# Altium schematic sheet Sheet1.SchDoc
size A4
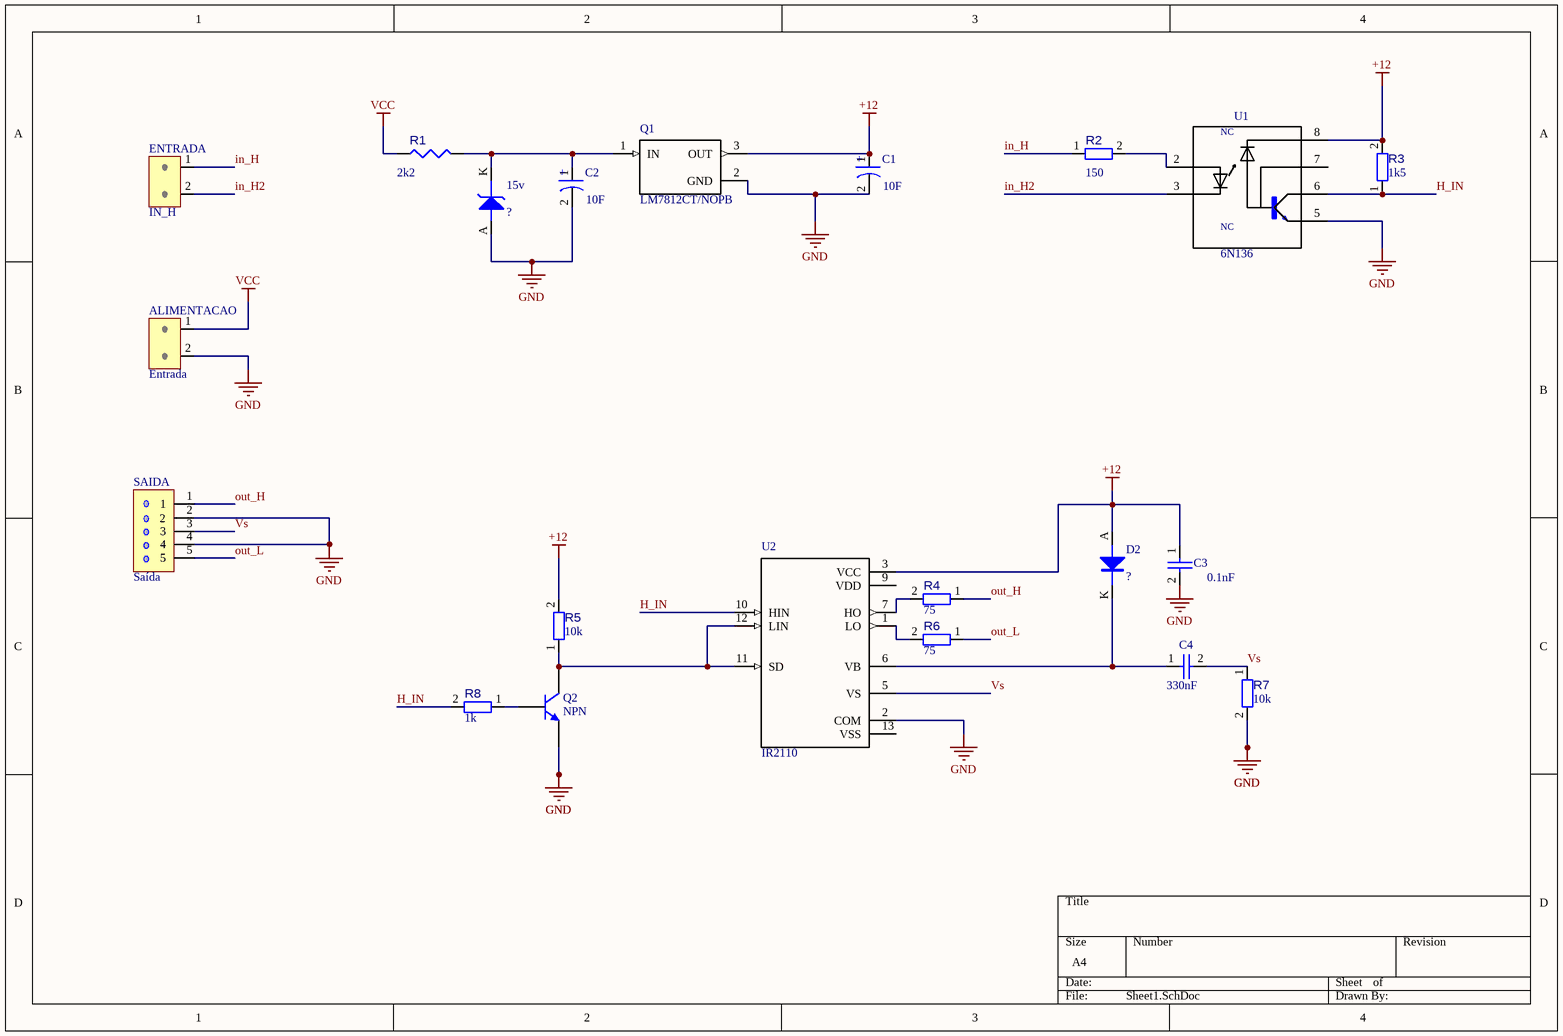
[diagram p0: Sheet1.SchDoc]

## Parts
15v  DIO_ZENER_DO35  [DIO_PTH_DO35]  (value not drawn)
ALIMENTACAO  Entrada  [HEADER_1X2]
C1  value 10F  [CAP_ALU_RADIAL_5MM]  (hidden comment: Electrolytic Capacitor)
C2  value 10F  [CAP_ALU_RADIAL_5MM]  (hidden comment: Electrolytic Capacitor)
C3  value 0.1nF  [Cap_POL_RADIAL_10mm]  (hidden comment: CAP_POL_RADIAL_16MM)
C4  value 330nF  [CAP_POL_RADIAL_16MM]  (hidden comment: CAP_POL_RADIAL_25.5MM)
D2  DIO_PTH_1N4007  [DIO_PTH_DO41]  (value not drawn)
ENTRADA  IN_H  [HEADER_1X2]
Q1  LM7812CT/NOPB  [*TO254P1054X470X2600-3]
Q2  NPN  [369-03]
R1  2k2  [RES_PTH_7.62MM]
R2  150  [RES_PTH_7.62MM]
R3  1k5  [RES_PTH_7.62MM]
R4  75  [RES_PTH_7.62MM]
R5  10k  [RES_PTH_7.62MM]
R6  75  [RES_PTH_7.62MM]
R7  10k  [RES_PTH_7.62MM]
R8  1k  [RES_PTH_7.62MM]
SAIDA  Saída  [CN_KK_5_5045-5]
U1  6N136  [*DIP762W50P254L977H451Q8]
U2  IR2110  [*DIP762W45P254L2019H533Q14]

## Nets
+12: C1.1 C3.1 D2.A Q1.3(OUT) R3.2 R5.2 U1.8(C/VCC) U2.3(VCC)
GND: 15v.A ALIMENTACAO.2 C1.2 C2.2 C3.2 Q1.2(GND) Q2.3(E) R7.2 SAIDA.2 SAIDA.4 U1.5(E/GND) U2.2(COM)
VCC: ALIMENTACAO.1 R1.1
H_IN: R3.1 R8.2 U1.6(C/VO) U2.10(HIN)
in_H: ENTRADA.1 R2.1
in_H2: ENTRADA.2 U1.3(C)
out_H: R4.1 SAIDA.1
out_L: R6.1 SAIDA.5
Vs: C4.2 R7.1 SAIDA.3 U2.5(VS)
Net15v_K: 15v.K C2.1 Q1.1(IN) R1.2
NetC4_1: C4.1 D2.K U2.6(VB)
NetQ2_1: Q2.1(C) R5.1 U2.11(SD) U2.12(LIN)
NetQ2_2: Q2.2(B) R8.1
NetR2_2: R2.2 U1.2(A)
NetR4_2: R4.2 U2.7(HO)
NetR6_2: R6.2 U2.1(LO)

Not connected (* = marked no-connect by the designer): U1 7(B/VB); U2 9(VDD) 13(VSS)

## Notes on the sheet
- (in symbol 6N136) NC
- (in symbol CAP_ALU_RADIAL_5MM) +

## Library data of the parts
ALIMENTACAO ENTRADA = CN_MKDS_2: MKDS_2; Value: ?
  ALIMENTACAO: Footprint: Entrada
C1 C2 = CAP_ALU_RADIAL_5MM: PTH Radial Electrolytic Capacitor; Tensão: ?
C3 = CAP_POL_RADIAL_16MM: PTH Radial Polyester Capacitor; Tensão: ?
C4 = CAP_POL_RADIAL_25.5MM: PTH Radial Polyester Capacitor; Tensão: ?
Q1 = LM7805CT/NOPB: Linear Voltage Regulator IC Positive Fixed 1 Output 1A TO-220-3; MF: ON Semiconductor; Package: TO-220 ON Semiconductor; MP: LM7805CT; SnapEDA_Link: https://www.snapeda.com/parts/LM7805CT/ON%20Semiconductor/view-part/546231/?ref=snap; Availability: Unavailable; Price: None; Value: *
Q2 = NPN: NPN Bipolar Transistor; Published: 8-Jun-2000; LatestRevisionDate: 17-Jul-2002; LatestRevisionNote: Re-released for DXP Platform.; PackageReference: TO-226-AA; Publisher: Altium Limited; PackageDescription: TO, Flat Index; 3 In-Line, Axial Leads; Body Dia. 4.8mm; Leads 0.55 x 0.51 mm (max); Code_JEDEC: TO-226-AA
R1 = RES_PTH_7.62MM: Pin Through Hole Resistor 7.62mm; Value: 2k2
R2-R8 = RES_SMD_0805: SMD 0805 Resistor
  R2: Value: 150
  R3: Value: 1k5
  R4 R6: Value: 75
  R5 R7: Value: 10k
  R8: Value: 1k
SAIDA = CN_KK_5: KK_5; Value: ?
U1 = 6N136: Optocoupler DC-IN 1-CH Transistor With Base DC-OUT 8-Pin PDIP; MF: Vishay Semiconductor; Package: DIP-8 Vishay Semiconductor; MP: 6N136; SnapEDA_Link: https://www.snapeda.com/parts/6N136/Vishay%20Semiconductor%20Opto%20Division/view-part/2773791/?ref=snap; Availability: Unavailable; Price: None; Value: *
U2 = IR2110: Half-Bridge Gate Driver IC Non-Inverting 14-DIP; MF: Infineon; Availability: Unavailable; MP: IR2110; SnapEDA_Link: https://www.snapeda.com/parts/IR2110/Infineon%20Technologies/view-part/549251/?ref=snap; Price: None; Package: DIP-14 Infineon; Value: *
15v = DIO_ZENER_DO35: Value: ?
D2 = DIO_PTH_1N4007: Value: ?